# EAGLE design 0116-class-d-amp (EAGLE 9.6.2)
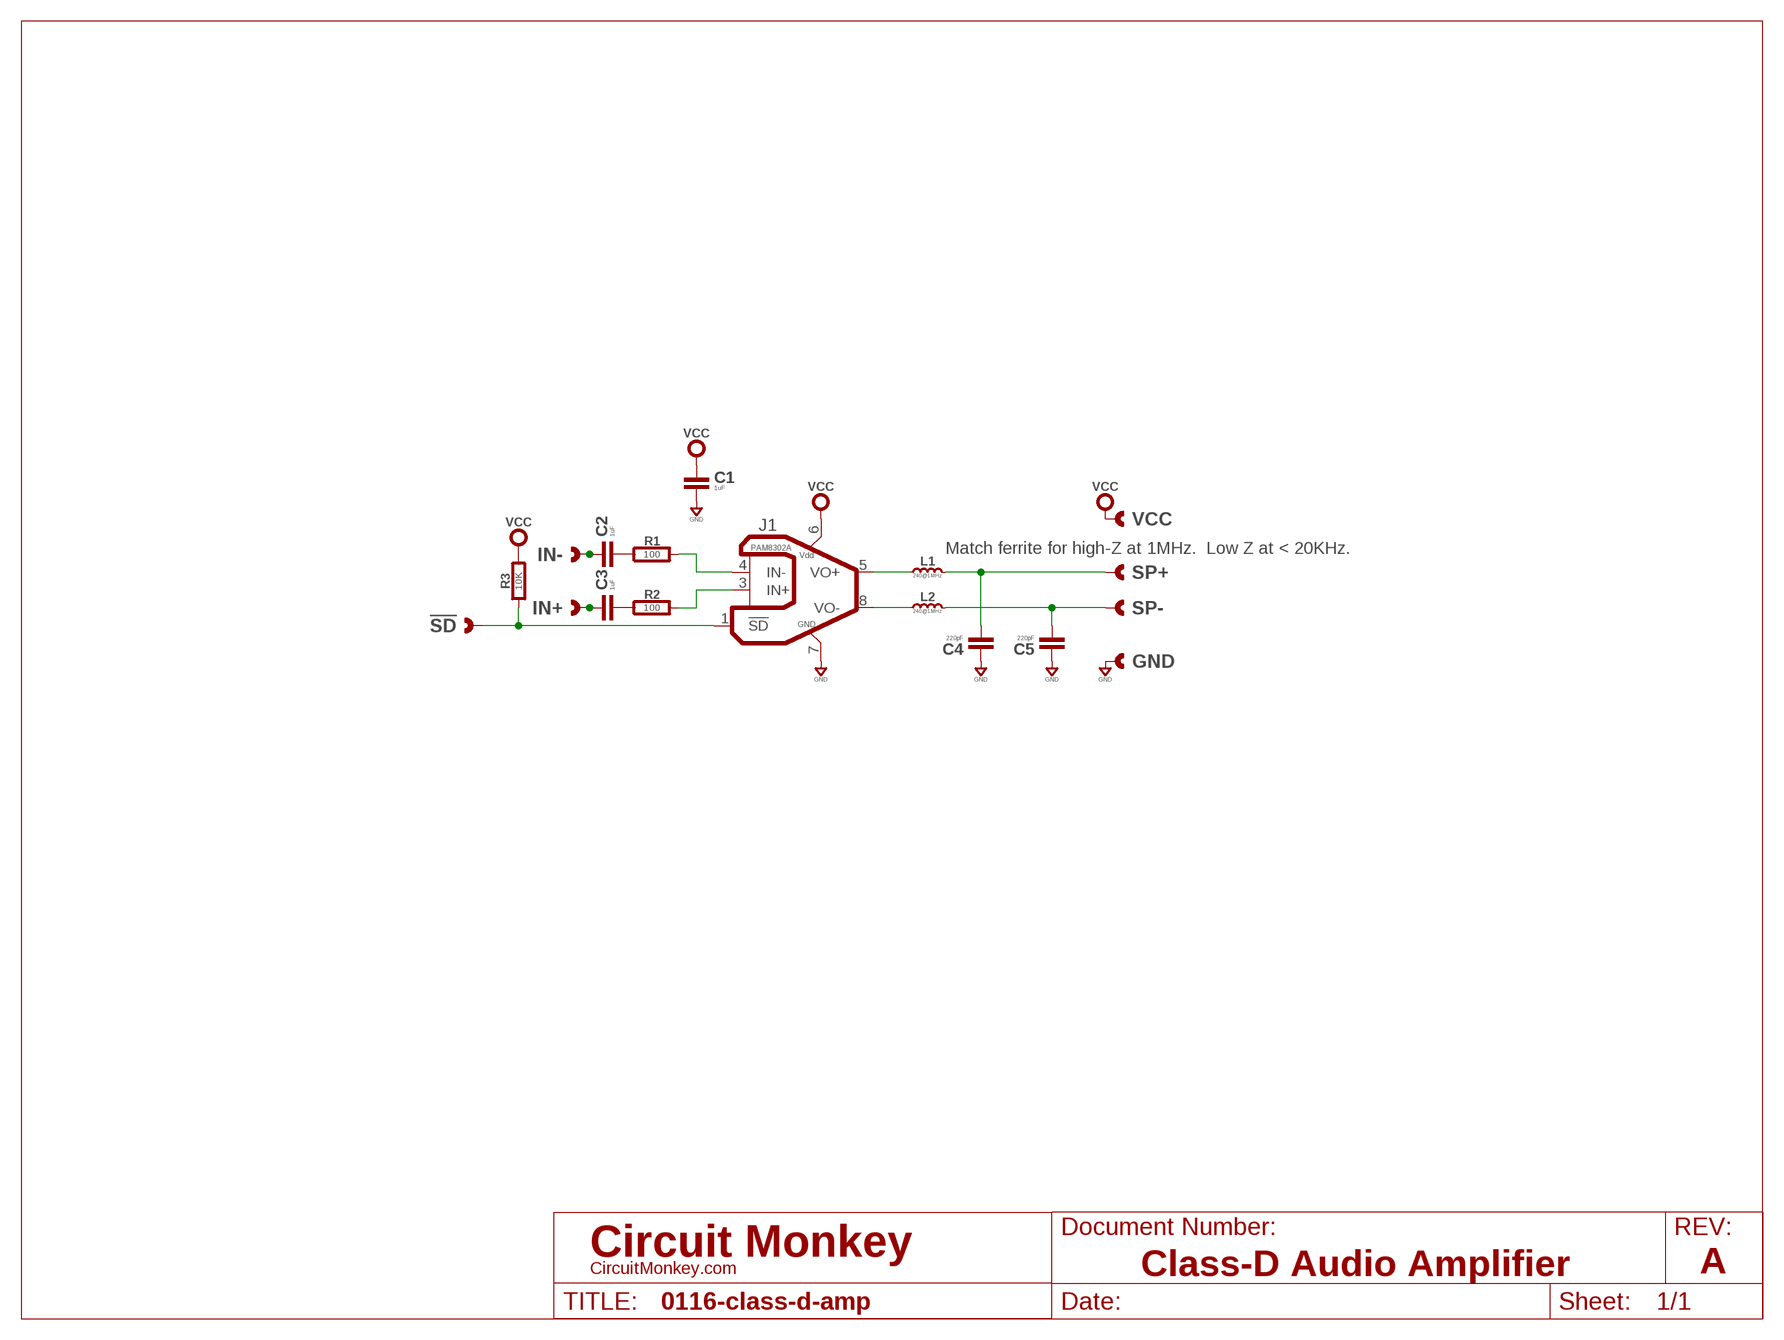
[diagram p0: schematic, sheet 1]
U$1 (LETTER_L-CIRCUITMONKEY): DOCUMENT_NUMBER: Class-D Audio Amplifier; REV: A

## Parts
!SD  CAST-01X12.00MM  [CAST01-2.00MM]
C1  1uF  CAPACITOR0402  [0402-CAP]
C2  1uF  CAPACITOR0402  [0402-CAP]
C3  1uF  CAPACITOR0402  [0402-CAP]
C4  220pF  CAPACITOR0402  [0402-CAP]
C5  220pF  CAPACITOR0402  [0402-CAP]
GND  CAST-01X12.00MM  [CAST01-2.00MM]
IN+  CAST-01X12.00MM  [CAST01-2.00MM]
IN-  CAST-01X12.00MM  [CAST01-2.00MM]
J1  PAM8302A  PAM8302ADFN-3X3  [DFN-8-3X3]
L1  240@1MHz  FERRITE240OHM-600MA-0402  [0402-IND]
L2  240@1MHz  FERRITE240OHM-600MA-0402  [0402-IND]
R1  100  RESISTOR0402  [0402-RES]
R2  100  RESISTOR0402  [0402-RES]
R3  10K  RESISTOR0402  [0402-RES]
SP+  CAST-01X12.00MM  [CAST01-2.00MM]
SP-  CAST-01X12.00MM  [CAST01-2.00MM]
VCC  CAST-01X12.00MM  [CAST01-2.00MM]

## Nets
!SD: !SD.1 !SD.P$1 !SD.P$2 J1.1(!SD) R3.1
GND: C1.2 C4.1 C5.1 GND.1 GND.P$1 GND.P$2 J1.7(GND)
N$1: C2.2 R1.1
N$2: C3.2 R2.1
N$3: J1.4(IN-) R1.2
N$4: J1.3(IN+) R2.2
N$5: C4.2 L1.4 SP+.1 SP+.P$1 SP+.P$2
N$6: C2.1 IN-.1 IN-.P$1 IN-.P$2
N$7: C3.1 IN+.1 IN+.P$1 IN+.P$2
N$8: C5.2 L2.4 SP-.1 SP-.P$1 SP-.P$2
N$9: J1.5(VO+) L1.3
N$10: J1.8(VO-) L2.3
VCC: C1.1 J1.6(VDD) R3.2 VCC.1 VCC.P$1 VCC.P$2

## Notes on the sheet
- Match ferrite for high-Z at 1MHz.  Low Z at < 20KHz.

## Library data of the parts
!SD GND IN+ IN- SP+ SP- VCC = con-headers:CAST-01X1: Castelated Edge Hole Pad
C1-C5 = rlc:CAPACITOR: Capacitor
J1 = op-amp:PAM8302A: Audio Amplifier, Class-D, 3.5W; COST01: 0.65; MFR: Diodes, Inc.; MPN: PAM8302AAYC
L1 L2 = rlc:FERRITE: 303030001; COST01: .1; MFR: TDK; MPN: MMZ1005S241HT000
R1-R3 = rlc:RESISTOR: Resistor

## Board
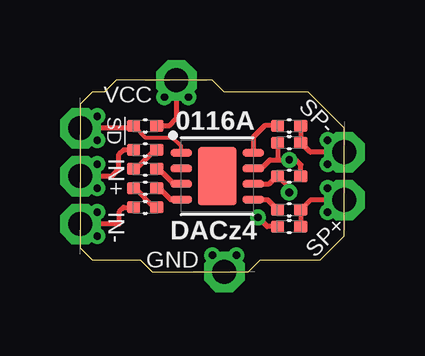
[diagram p1: board, top side]
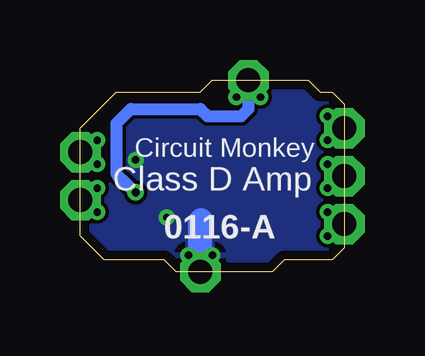
[diagram p2: board, bottom side, seen from below]

Size 11 x 8 mm. Coordinates in mm from the lower left corner, seen from the top.
Outline: 3,0 7,0 7.5,0.5 10,0.5 11,1.5 11,6 9.5,7.5 6,7.5 5.5,8 1.5,8 1,7.5 0.5,7.5 0,7 0,1 0.5,0.5 2.5,0.5 3,0
Copper layers (1*16): Top 0.0356mm / dielectric 0.7011mm / Bottom 0.0356mm
Design rules "OSH-CircuitMonkey *": minimum track width 6mil, minimum drill 12mil, track to track 6mil, track to pad 6mil, pad to pad 6mil, via to via 6mil, smd to smd 6mil, copper to edge 15mil, drill to drill 6mil, minimum pad ring 7mil, minimum via ring 7mil, stop-mask expansion 3mil, vias tented up to drill 13mil, thermal gap 10mil

### Footprints (pad centres in the part's own frame; a part is rotated, then mirrored left to right if it is on the bottom)
CAST01-2.00MM = drill 1 pad 1.7 octagon: 1 0,0 | drill 0.305: P$1 -0.7,0.5; P$2 -0.7,-0.5
0402-CAP = smd 0.559 x 0.508: 1 -0.483,0; 2 0.483,0
DFN-8-3X3 = smd 0.3 x 0.9: 1 -0.975,-1.5; 2 -0.325,-1.5; 3 0.325,-1.5; 4 0.975,-1.5; 5 0.975,1.5; 6 0.325,1.5; 7 -0.325,1.5; 8 -0.975,1.5 | smd 2.4 x 1.6: PAD 0,0
0402-IND = smd 0.559 x 0.508: 3 -0.483,0; 4 0.483,0
0402-RES = smd 0.559 x 0.508: 1 -0.483,0; 2 0.483,0

### Placement (x,y rotation side)
!SD  0,6 180 top
C1  8.7,4 0 top
C2  2.7,2.7 0 top
C3  2.7,5.1 0 top
C4  8.7,1.9 0 top
C5  8.7,5.4 0 top
GND  6,0 270 top
IN+  0,4 180 top
IN-  0,2 180 top
J1  5.7,4 270 top
L1  8.7,2.6 0 top
L2  8.7,6.1 0 top
R1  2.7,3.5 0 top
R2  2.7,4.3 0 top
R3  2.7,6.1 0 top
SP+  11,3 0 top
SP-  11,5 0 top
VCC  4,8 90 top

### Tracks (layer width: path | path; a pad name or v marks a point on that pad's centre or on a via)
!SD
  Top 0.16: J1.1 4.2,5.26 3.85,5.6 2.72,5.6 2.24,6.1 | 0.2,6 !SD.P$2 | !SD.1 0.2,6 | 0.2,6 !SD.P$1
  Top 0.2: !SD.1 2.12,6 R3.1 2.24,6.1
GND  (via drill 0.3)
  Top 0.16: 6,0.2 GND.P$1 | GND.1 6,0.2 | 6,0.2 GND.P$2
  Top 0.2: C1.2 9.18,4.47 8.99,4.66 v8.7,4.68 8.2,4.68 | 7.37,4.33 J1.7 7.54,4.33 7.89,4.68 8.2,4.68 | C5.1 8.22,4.7 8.2,4.68 | C4.1 7.78,1.9 v7.4,2.28
  Bottom 1: GND.1 6,2.11 5.97,2.16
  pour Bottom: 0,0 0,8 11,8 11,0
N$1
  Top 0.2: C2.2 3.08,2.7 2.28,3.5 R1.1
N$2
  Top 0.2: R2.1 2.3,4.3 3.1,5.1 C3.2
N$3
  Top 0.2: J1.4 3.76,3.02 3.28,3.5 R1.2
N$4
  Top 0.2: J1.3 3.88,3.67 3.26,4.3 R2.2
N$5
  Top 0.16: 10.8,3 SP+.P$1 | SP+.1 10.8,3 | 10.8,3 SP+.P$2
  Top 0.2: C4.2 L1.4 9.58,3 SP+.1
N$6
  Top 0.16: IN-.P$2 0.2,2 | IN-.1 0.2,2 | 0.2,2 IN-.P$1
  Top 0.2: C2.1 1.8,2.7 1.6,2.5 1.6,2 IN-.1
N$7
  Top 0.16: 0.2,4 IN+.P$2 | IN+.1 0.2,4 | 0.2,4 IN+.P$1
  Top 0.2: C3.1 1.8,5.1 1.61,4.91 1.61,4.31 1.3,4 IN+.1
N$8
  Top 0.16: 10.8,5 SP-.P$1 | SP-.1 10.8,5 | 10.8,5 SP-.P$2
  Top 0.2: L2.4 C5.2 9.58,5 SP-.1
N$9
  Top 0.2: J1.5 7.79,3.02 L1.3
N$10
  Top 0.2: L2.3 8.13,6.1 8.12,6.11 7.68,6.11 7.2,5.63 J1.8
VCC  (via drill 0.33)
  Top 0.16: VCC.P$2 4,7.8 | VCC.1 4,7.8 | 4,7.8 VCC.P$1
  Top 0.2: J1.6 7.88,3.67 8.2,4 C1.1 8.22,3.99 8.7,3.52 v8.7,3.32 | R3.2 3.68,6.1 4,6.42 VCC.1
  Bottom 0.5: VCC.1 4,6.8 4.3,6.5 5.7,6.5 6,6.8 8.9,6.8 9.5,6.2 9.5,4.1 v8.7,3.32

### Text on the board
tPlace: 0116A | DACz4
bPlace: Circuit Monkey | Class D Amp | 0116-A